# Altium schematic sheet 230C_5V_PSU_TPS40200.SchDoc: Communications
size Tabloid; CompanyName: Vertex; Organization: Vertex Downhole Ltd.; Address1: 7004 5 St SE Unit C; Address2: Calgary, AB; Address3: T2H 2G3; Address4: Canada; DocumentNumber: 550014; Revision: 4.1; SheetNumber: 6; SheetTotal: 8; Operating Temperature Range: -55°C ~ 230°C
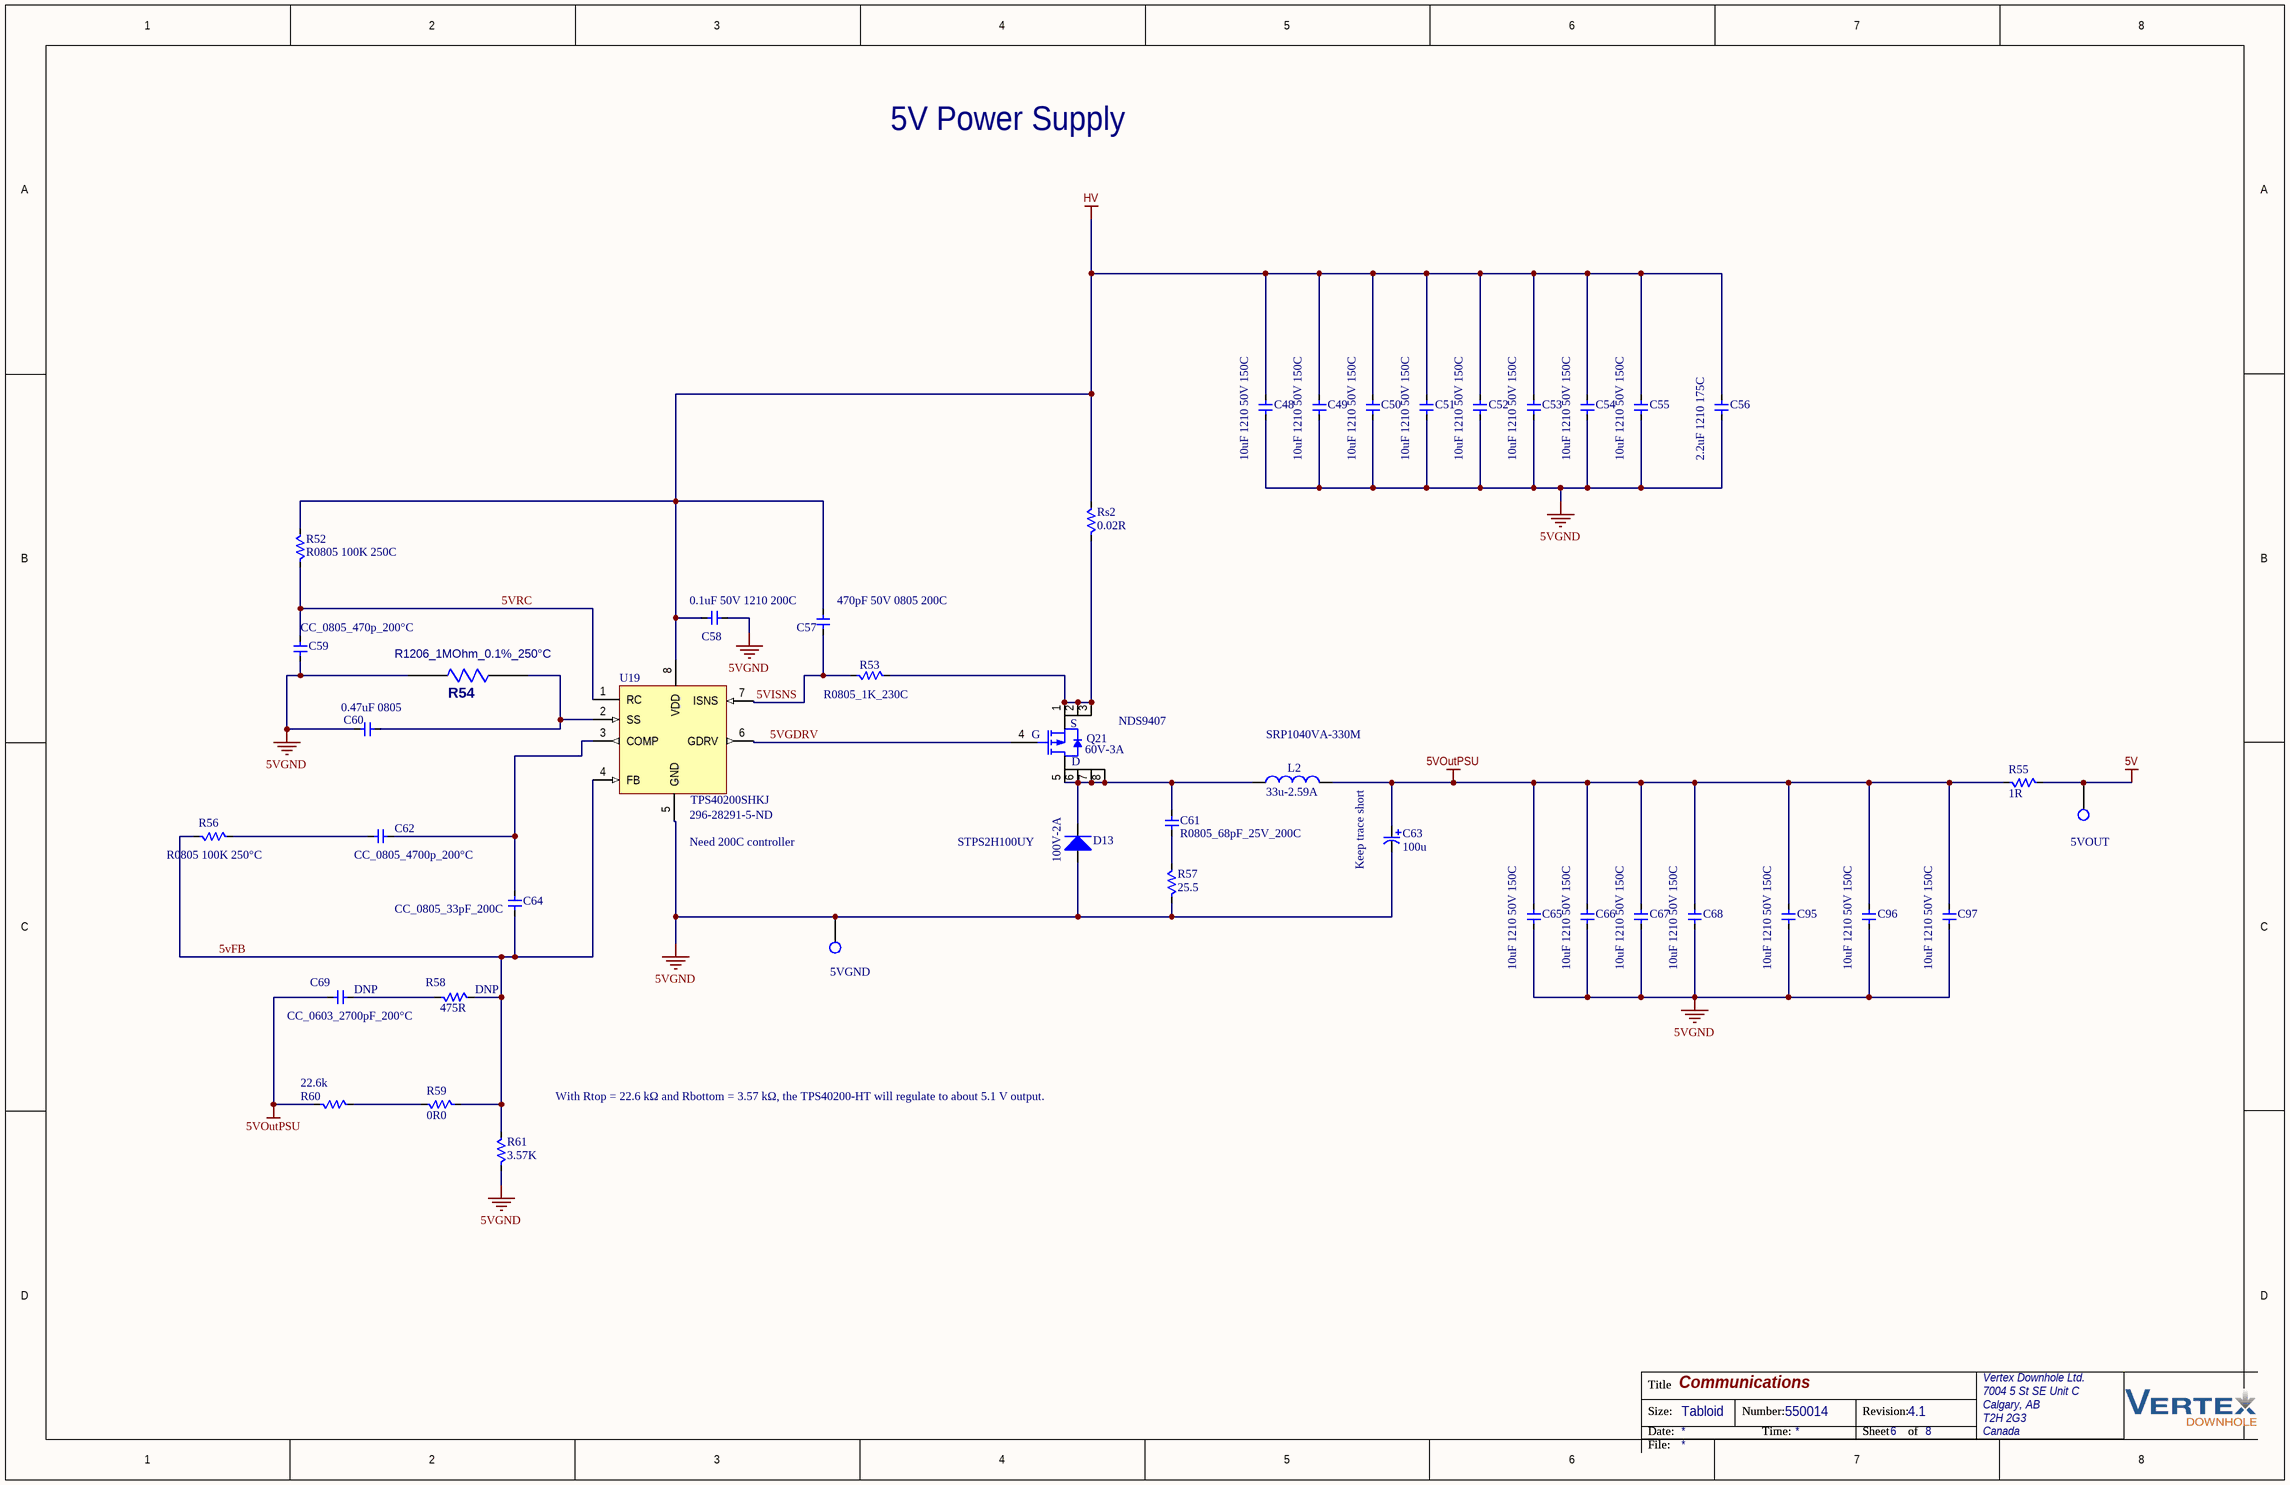
[diagram p0: 230C_5V_PSU_TPS40200.SchDoc]

## Parts
3  5VOUT  [TP-S]  (no BOM)
4  5VGND  [TP-S]  (no BOM)
C48  value 10uF 1210 50V 150C  [1210]  (hidden comment: GCM32EL8EH106KA07K)
C49  value 10uF 1210 50V 150C  [1210]  (hidden comment: GCM32EL8EH106KA07K)
C50  value 10uF 1210 50V 150C  [1210]  (hidden comment: GCM32EL8EH106KA07K)
C51  value 10uF 1210 50V 150C  [1210]  (hidden comment: GCM32EL8EH106KA07K)
C52  value 10uF 1210 50V 150C  [1210]  (hidden comment: GCM32EL8EH106KA07K)
C53  value 10uF 1210 50V 150C  [1210]  (hidden comment: GCM32EL8EH106KA07K)
C54  value 10uF 1210 50V 150C  [1210]  (hidden comment: GCM32EL8EH106KA07K)
C55  value 10uF 1210 50V 150C  [1210]  (hidden comment: GCM32EL8EH106KA07K)
C56  value 2.2uF 1210 175C  [1210]  (hidden comment: C1206H104J3GACTU)
C57  value 470pF 50V 0805 200C  [1210]  (hidden comment: C1206H104J3GACTU)
C58  value 0.1uF 50V 1210 200C  [0805]  (hidden comment: 0805D121J251KHT)
C59  value CC_0805_470p_200°C  [0805]  (hidden comment: C0805H471J1GACTU)
C60  value 0.47uF 0805  [0805]  (hidden comment: C0805C272K5HACTU)
C61  value R0805_68pF_25V_200C  [0805]  (hidden comment: C0805H680J3GACTU)
C62  value CC_0805_4700p_200°C  [0805]  (hidden comment: C0805H472J1GACT500)
C63  value 100u  [0805]  (hidden comment: 0805D121J251KHT)
C64  value CC_0805_33pF_200C  [1210]  (hidden comment: C1206H104J3GACTU)
C65  value 10uF 1210 50V 150C  [1210]  (hidden comment: GCM32EL8EH106KA07K)
C66  value 10uF 1210 50V 150C  [1210]  (hidden comment: GCM32EL8EH106KA07K)
C67  value 10uF 1210 50V 150C  [1210]  (hidden comment: GCM32EL8EH106KA07K)
C68  value 10uF 1210 50V 150C  [1210]  (hidden comment: GCM32EL8EH106KA07K)
C69  value CC_0603_2700pF_200°C  [0603]  (hidden comment: C1206H104J3GACTU)
C95  value 10uF 1210 50V 150C  [1210]  (hidden comment: GCM32EL8EH106KA07K)
C96  value 10uF 1210 50V 150C  [1210]  (hidden comment: GCM32EL8EH106KA07K)
C97  value 10uF 1210 50V 150C  [1210]  (hidden comment: GCM32EL8EH106KA07K)
D13  value 100V-2A  [SMB]  (hidden comment: STPS2H100UY)
L2  value 33u-2.59A  [IND_CB_DRA125]  (hidden comment: DRA125-470-R)
Q21  value 60V-3A  [SOIC_S9407_ONS]  (hidden comment: NDS9407)
R52  value R0805 100K 250C  [0805]  (hidden comment: PATT0805E1003BGT1)
R53  value R0805_1K_230C  [0805]  (hidden comment: ERJ-PB6B6812V)
R54  R1206_1MOhm_0.1%_250°C  [1206]
R55  value 1R  [0805]  (hidden comment: RS73F2ATTD1501B)
R56  value R0805 100K 250°C  [0805]  (hidden comment: PATT0805E1003BGT1)
R57  value 25.5  [0805]  (hidden comment: ERJ-PB6B1004V)
R58  value 475R  [0805]  (hidden comment: ERJ-PB6B6812V)
R59  value 0R0  [0805]  (hidden comment: PATT0603E49R9BGT1)
R60  value 22.6k  [0805]  (hidden comment: PATT0805E1003BGT1)
R61  value 3.57K  [0805]  (hidden comment: RNCP0805FTD1R00)
Rs2  value 0.02R  [1206]  (hidden comment: ERJ-8CWFR020V)
U19  Supplier Part Number 1: 296-28291-5-ND  [SOIC_S9407_ONS]  (hidden comment: TPS40200SHKJ)

## Nets
5V: 3.1 R55.2
5VGND: 4.1 C48.1 C49.1 C50.1 C51.1 C52.1 C53.1 C54.1 C55.1 C56.1 C58.2 C59.1 C60.1 C63.2 C65.1 C66.1 C67.1 C68.1 C95.1 C96.1 C97.1 D13.A R54.1(A) R57.1 R61.1 U19.5(GND)
5VOutPSU: C63.1 C65.2 C66.2 C67.2 C68.2 C69.1 C95.2 C96.2 C97.2 L2.2 R55.1 R60.1
HV: C48.2 C49.2 C50.2 C51.2 C52.2 C53.2 C54.2 C55.2 C56.2 C57.1 C58.1 R52.2 Rs2.2 U19.8(VDD)
5vFB: C64.1 R56.1 R58.2 R59.1 R61.2 U19.4(FB)
5VGDRV: Q21.4(G) U19.6(GDRV)
5VISNS: C57.2 R53.1 U19.7(ISNS)
5VRC: C59.2 R52.1 U19.1(RC)
NetC60_2: C60.2 R54.2(B) U19.2(SS)
NetC61_1: C61.1 R57.2
NetC61_2: C61.2 D13.K L2.1 Q21.5(D) Q21.6(D) Q21.7(D) Q21.8(D)
NetC62_1: C62.1 R56.2
NetC62_2: C62.2 C64.2 U19.3(COMP)
NetC69_2: C69.2 R58.1
NetQ21_1: Q21.1(S) Q21.2(S) Q21.3(S) R53.2 Rs2.1
NetR59_2: R59.2 R60.2

## Notes on the sheet
- 5V Power Supply
- (near Q21) NDS9407
- (near L2) SRP1040VA-330M
- (near U19) Need 200C controller
- STPS2H100UY
- Keep trace short
- (near C69) DNP
- (near R58) DNP
- With Rtop = 22.6 kΩ and Rbottom = 3.57 kΩ, the TPS40200-HT will regulate to about 5.1 V output.
- Title
- Size:
- Date:
- Tabloid
- Number:
- Time:
- Revision:
- Sheet
- of
- File:

## Library data of the parts
3 4 = TP: Test  Point; Number: PMT104887; Subtype: Test Loop; Num Connections: 1; RoHS: 0; Package: Through hole
C48 C65 = CC-1210: CAP CER 0.1UF 50V C0G/NP0 1210 200C; Tolerance: ±10%; Temp. Coeff.: X8L; Mfg: Murata Electronics; Vendor: Digi-Key; VendorPN: 490-GCM32EL8EH106KA07KCT-ND; Do not load: 0; Class: Epart; CES#: *; Voltage: 50V; Temperature: -55°C ~ 150°C; Height: 1.6mm; MfgPN: GCM32EL8EH106KA07K; Unit Price: 19.5; Notes: *; Package: CC-1210; Dimension: 3.20mm x 1.60mm; #1Mfg: *; #1MfgPN: *; Temperature Tested: *
C49-C55 C66-C68 C95-C97 = CC-1210: CAP CER 0.1UF 50V C0G/NP0 1210 200C; Tolerance: ±5%; Temp. Coeff.: X8L; Mfg: Murata Electronics; Vendor: Digi-Key; VendorPN: 490-GCM32EL8EH106KA07KCT-ND; Do not load: 0; Class: Epart; CES#: *; Voltage: 50V; Temperature: -55°C ~ 200°C; Height: 1.6mm; MfgPN: GCM32EL8EH106KA07K; Unit Price: 19.5; Notes: *; Package: CC-1210; Dimension: 3.20mm x 1.60mm; #1Mfg: *; #1MfgPN: *; Temperature Tested: *
C56 = CC-1210: CAP CER 0.1UF 50V C0G/NP0 1210 200C; Voltage: 25V; Tolerance: ±5%; Temp. Coeff.: C0G, NP0; Mfg: KEMET; Vendor: Digi-Key; VendorPN: 399-5750; Do not load: 0; Class: Epart; CES#: *; Temperature: -55°C ~ 200°C; Height: 1.6mm; MfgPN: C1206H104J3GACTU; Unit Price: 19.5; Notes: *; Package: CC-1206; Dimension: 3.20mm x 1.60mm; #1Mfg: *; #1MfgPN: *; Temperature Tested: *
C57 = CC-0805-100p-100V-10%-200C-NP0: CAP CER 470PF 50V C0G/NP0 0805 200C; Voltage: 100V; Tolerance: ±5%; Temp. Coeff.: C0G, NP0; Mfg: Vishay Vitramont; MfgPN: VJ0805D471JXAQJHT; Vendor: Digi-Key; VendorPN: 720-VJ0805D471JXAQJHTCT-ND; Do not load: 0; Class: Epart; Temperature: -55°C ~ 200°C; Height: 1.37mm; Unit Price: 0.34; Notes: *; Package: CC-0805; Dimension: 1.60mm x 0.80mm; #1Mfg: *; #1MfgPN: *; Temperature Tested: *
C58 = CC-1210: CAP CER 0.1UF 50V C0G/NP0 1210 200C; Voltage: 25V; Tolerance: ±5%; Temp. Coeff.: C0G, NP0; Mfg: KEMET; MfgPN: C1206H104J3GACTU; Vendor: Digi-Key; VendorPN: 399-5750; Do not load: 0; Class: Epart; CES#: *; Temperature: -55°C ~ 200°C; Height: 1.6mm; Unit Price: 19.5; Notes: *; Package: CC-1206; Dimension: 3.20mm x 1.60mm; #1Mfg: *; #1MfgPN: *; Temperature Tested: *
C59 = CC-0805-470p-100V-10%-150C-NP0: CAPACITOR CER 470PF 100V C0G/NP0 0805; Tolerance: ±10%; Temp. Coeff.: C0G, NP0; Mfg: KEMET; Vendor: Digi-Key; VendorPN: 720-1262; Do not load: 0; Class: Epart; CES#: *; Voltage: 100V; Temperature: -55°C ~ 200°C; Height: 1.25mm; MfgPN: C0805H471J1GACTU; Unit Price: 0.47; Notes: *; Package: CC-0805; Dimension: 2.00mm x 1.25mm; #1Mfg: *; #1MfgPN: *; Temperature Tested: *
C60 = CC-0805-47n-25V-5%-125C-NP0: CAPACITOR CER 0.047UF 25V C0G/NP0 0805; Tolerance: ±5%; Temp. Coeff.: C0G, NP0; Mfg: KEMET; MfgPN: C0805C473J3GACAUTO; Vendor: Digi-Key; VendorPN: 399-6970; Do not load: 0; Class: Epart; CES#: *; Voltage: 25V; Temperature: -55°C ~ 125°C; Height: 1.25mm; Unit Price: 0.95; Notes: *; Package: CC-0805; Dimension: 2.00mm x 1.25mm; #1Mfg: *; #1MfgPN: *; Temperature Tested: *
C61 = CC-0805-2200p-100V-5%-200C-NP0: CAPACITOR CER 2200PF 100V C0G/NP0 0805; Tolerance: ±5%; Temp. Coeff.: C0G, NP0; Mfg: KEMET; Vendor: Mouser; VendorPN: 80-C0805H680J3G; Do not load: 0; Class: Epart; Voltage: 100V; Temperature: -55°C ~ 200°C; Height: 0.9mm; MfgPN: C0805H680J3GACTU; Unit Price: 2.65; Notes: *; Package: CC-0805; Dimension: 2.00mm x 1.25mm; #1Mfg: *; #1MfgPN: *; Temperature Tested: *; Supplier 1: Digi-Key
C62 = CC-0805-2200p-100V-5%-200C-NP0: CAPACITOR CER 2200PF 100V C0G/NP0 0805; Tolerance: ±5%; Temp. Coeff.: C0G, NP0; Mfg: KEMET; Vendor: Digi-Key; VendorPN: 399-9996-2-ND; Do not load: 0; Class: Epart; Voltage: 100V; Temperature: -55°C ~ 200°C; Height: 0.9mm; MfgPN: C0805H472J1GACT500; Unit Price: 2.65; Notes: *; Package: CC-0805; Dimension: 2.00mm x 1.25mm; #1Mfg: *; #1MfgPN: *; Temperature Tested: *; Supplier 1: Digi-Key
C63 = CT-2917-100u-16V-10%-150C: CAPACITOR TANT 100UF 16V 10% 2917; Mfg: KEMET; MfgPN: T498X107K016ATE075; Vendor: Digi-Key; VendorPN: 399-5207; Do not load: 0; Class: Epart; CES#: *; Voltage: 16V; Tolerance: ±10%; Temperature: -55°C ~ 150°C; Height: 4.1mm; Unit Price: 6.63; Notes: *; Package: CT-2917; Dimension: 7.30mm x 4.30mm; #1Mfg: *; #1MfgPN: *; Temperature Tested: *
C64 = CC-0805-120p-100V-5%-200C-NP0: CAPACITOR CER 120PF 250V NP0 0805; Tolerance: ±5%; Temp. Coeff.: C0G, NP0; Mfg: Knowles Novacap; MfgPN: 0805D121J251KHT; Vendor: Digi-Key; Do not load: 0; Class: Epart; Voltage: 250V; Temperature: -55°C ~ 200°C; Height: 1.37mm; VendorPN: 0805D121J251KHT; Unit Price: 0.25; Notes: *; Package: CC-0805; Dimension: 2.03mm x 1.27mm; #1Mfg: *; #1MfgPN: *; Temperature Tested: *
C69 = CC-0805-2700p-50V-10%-150C: CAPACITOR CER 2700PF 50V X8R 0805; Tolerance: ±5%; Temp. Coeff.: C0G; Mfg: KEMET; MfgPN: C0603H272J5GACTU; Vendor: Digi-Key; VendorPN: 399-C0603H272J5GACTUCT-ND; Do not load: 0; Class: Epart; CES#: *; Voltage: 50V; Temperature: -55°C ~ 200°C; Height: 1.25mm; Unit Price: 0.84; Notes: *; Package: CC-0805; Dimension: 2.00mm x 1.25mm; #1Mfg: *; #1MfgPN: *; Temperature Tested: *
D13 = DS-SMB-100V-2A: DIODE SCHOTTKY 100V 2A SMB; Mfg: STMicroelectronics; Vendor: Digi-Key; VendorPN: 497-11093; Do not load: 0; Class: Epart; CES#: *; Temperature: -40°C ~ 175°C; Voltage: 100V; Height: 1.9 mm; MfgPN: STPS2H100UY; Unit Price: 0.81; Notes: *; Current: 2A; Package: SMB; Dimension: 3.5 X 2.8 X 1.9 mm; #1Mfg: *; #1MfgPN: *; Temperature Tested: *
L2 = LL-12.5X12.5-47u-2.59A: INDUCTOR 47UH 2.59A 81 MOHM; DC Resistance (DCR): 81 mOhm; Mfg: Eaton; Vendor: Digi-Key; VendorPN: 283-3577; Do not Load: 0; Tolerance: ±20%; Class: Epart; CES#: *; Temperature: -40°C ~ 165°C; Height: 6 mm; MfgPN: DRA125-470-R; Unit Price: 4.36; Current: 2.59A; Package: LL-12.5X12.5; Dimension: 12.50mm x 12.50mm; #2Mfg: *; #2MfgPN: *; Temperature Tested: *
Q21 = QF-SOIC8-PCH-60V-3A: MOSFET P-CH 60V 3A 8-SOIC; Mfg: ON Semiconductor; Vendor: Digi-Key; Do not Load: 0; Power: 2.5W (Ta); Rds On: 150 mOhm @ 3A, 10V; Class: Epart; Temperature: -55°C ~ 175°C (TJ); Voltage: 60V; Height: 1.7 mm; MfgPN: NDS9407; VendorPN: NDS9407; Unit price: 1.55; Package: SOIC8; Dimension: 6.2 X 5.0 X 1.7 mm; Current: 3A; #2Mfg: *; #2MfgPN: *; Temperature Tested: *
R52 R56 R60 = RS-0805-9.1K-0.1%-1/4W-155C: 100 kOhms ±0.1% 0.2W, 1/5W Chip Resistor 0805 (2012 Metric); Temp. Coeff.: ±25ppm/°C; Mfg: Vishay Dale Thin Film; Vendor: Digi-Key; VendorPN: 764-1065-1-ND; Do not load: 0; Power: 0.25W; Class: Epart; Tolerance: ±0.1%; Temperature: -55°C ~ 250°C; Height: 0.46 mm; MfgPN: PATT0805E1003BGT1; Unit Price: 0.55; Notes: *; Package: RS-0805; Dimension: 1.60mm x 0.80mm; #2Mfg: *; #2MfgPN: *; Temperature Tested: *
R53 = RS-0805-1K-0.1%-1/8W-155C: RESISTOR SMD 1K OHM 0.1% 1/8W 0805; Tolerance: ±1%; Temp. Coeff.: ±25ppm/°C; Mfg: Vishay / Sfernice; MfgPN: CHPHT0805K1001FGT; Vendor: Mouser; VendorPN: 71-CHPHT0805K1001FGT; Do not load: 0; Power: 0.125W; Class: Epart; CES#: *; Temperature: -55°C ~ 230°C; Height: 0.7 mm; Notes: *; Package: RS-0805; Dimension: 2.00mm x 1.25mm; #2Mfg: *; #2MfgPN: *; Temperature Tested: *
R54 = RC_1206: 1206; Part Field 1: Description Resistor in 1206 package; MPN: PATT1206E1004BGT1; Mfr: Vishay Dale Thin Film
R55 = RS-0805-1R-1%-0.25W-155C: RESISTOR SMD 1 OHM 1% 1/4W 0805; Temp. Coeff.: ±100ppm/°C; Mfg: Stackpole Electronics Inc.; MfgPN: RNCP0805FTD1R00; Vendor: Digi-Key; Do not load: 0; Power: 0.25W; Class: Epart; CES#: *; Tolerance: ±1%; Temperature: -55°C ~ 155°C; Height: 0.7 mm; VendorPN: RNCP0805FTD1R00; Unit Price: 0.15; Notes: *; Package: RS-0805; Dimension: 2.00mm x 1.25mm; #2Mfg: *; #2MfgPN: *; Temperature Tested: *
R57 = RS-0805-10.2K-0.1%-0.25W-155C: RESISTOR SMD 10.2K OHM 1% 1/4W 0805; Temp. Coeff.: ±50ppm/°C; Mfg: Panasonic Electronic Components; MfgPN: ERJ-PB6B1022V; Vendor: Digi-Key; VendorPN: P20709TR-ND; Do not load: 0; Power: 0.25W; Class: Epart; Tolerance: ±1%; Temperature: -55°C ~ 155°C; Height: 0.7 mm; Unit Price: 0.55; Notes: *; Package: RS-0805; Dimension: 2.00mm x 1.25mm; #2Mfg: *; #2MfgPN: *; Temperature Tested: *
R58 = RS-0805-475R-0.1%-0.25W-155C: RESISTOR SMD 475 OHM 0.1% 1/10W 0805; Temp. Coeff.: ±50ppm/°C; Mfg: Panasonic Electronic Components; MfgPN: ERJ-PB6B4750V; Vendor: Digi-Key; VendorPN: P20557; Do not load: 0; Power: 0.25W; Class: Epart; Tolerance: ±0.1%; Temperature: -55°C ~ 155°C; Height: 0.7 mm; Unit Price: 0.55; Notes: *; Package: RS-0805; Dimension: 2.00mm x 1.25mm; #2Mfg: *; #2MfgPN: *; Temperature Tested: *
R59 = RS-0805-1.5K-0.1%-1/4W-155C: 49.9 Ohms ±0.1% 0.15W Chip Resistor 0603 (1608 Metric) Anti-Sulfur, Automotive AEC-Q200, Moisture Resistant Thin Film; Temp. Coeff.: ±25ppm/°C; Mfg: Vishay Dale Thin Film; Vendor: Digi-Key; VendorPN: 764-1019-1-ND; Do not load: 0; Power: 0.250W; Class: Epart; CES#: *; Tolerance: ±0.1%; Temperature: -55°C ~ 255°C; Height: 0.46 mm; MfgPN: PATT0603E49R9BGT1; Notes: *; Package: RS-0805; Dimension: 2.00mm x 1.25mm; #2Mfg: *; #2MfgPN: *; Temperature Tested: *
R61 = RS-0805-49.9R-0.25%-0.25W-155C: RESISTOR SMD 49.9 OHM 0.1% 1/25W 0805; Temp. Coeff.: ±25ppm/°C; Mfg: KOA Speer Electronics, Inc.; MfgPN: RS73G2ATTD49R9C; Vendor: Digi-Key; VendorPN: 2019-RS73G2ATTD49R9CTR-ND; Do not load: 0; Power: 0.25W; Class: Epart; Tolerance: ±0.1%; Temperature: -55°C ~ 155°C; Height: 0.5 mm; Unit Price: 0.113; Notes: *; Package: RS-0603; Dimension: 1.60mm x 0.80mm; #2Mfg: *; #2MfgPN: *; Temperature Tested: *
Rs2 = RS-1206-0.02R-1%-1W-155C: RESISTOR SMD 0.02 OHM 1% 1W 1206; Temp. Coeff.: ±75ppm/°C; Mfg: Panasonic Electronic Components; Vendor: Digi-Key; VendorPN: P0.02BV; Do not load: 0; Class: Epart; CES#: *; Tolerance: ±1%; Temperature: -55°C ~ 155°C; Height: 0.6; MfgPN: ERJ-8CWFR020V; Unit Price: 1.04; Notes: *; Power: 1W; Package: RS-1206; Dimension: 1.60mm x 3.20mm; #2Mfg: *; #2MfgPN: *; Temperature Tested: *
U19 = UP-SREG-CFP8-Buck-ADJ-TPS40200: IC REG CTRLR BUCK 8CFP; Mfg: Texas Instruments; Vendor: Digi-Key; VendorPN: 296-28291; Do not load: 0; Voltage Output: Adjustive; Voltage Input: 5.5 V ~ 52 V; Class: Epart; Topology: Buck; Temperature: -55°C ~ 210°C (TA); Height: 2.0 mm; MfgPN: TPS40200SHKJ; Unit Price: 140.54; Notes: *; Package: CFP-8; Dimension: 24.7 X 7.3 X 2.0; #2Mfg: *; #2MfgPN: *; Temperature Tested: *; Value: TPS40200SHKJ; Supplier 1: Digi-Key